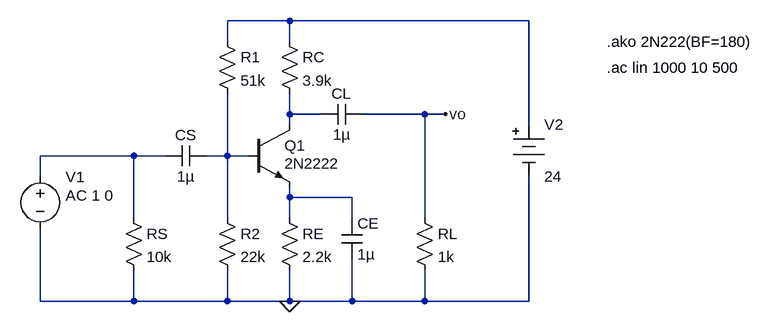
[diagram p0: schematic Draft23.asc]
Draft23.asc, the LTspice schematic file:
Version 4
SHEET 1 1008 680
WIRE 272 -80 176 -80
WIRE 640 -80 272 -80
WIRE 176 -48 176 -80
WIRE 272 -48 272 -80
WIRE 272 64 272 32
WIRE 320 64 272 64
WIRE 480 64 384 64
WIRE 512 64 480 64
WIRE 272 80 272 64
WIRE 640 80 640 -80
WIRE 32 128 -112 128
WIRE 80 128 32 128
WIRE 176 128 176 32
WIRE 176 128 144 128
WIRE 208 128 176 128
WIRE -112 160 -112 128
WIRE 272 192 272 176
WIRE 368 192 272 192
WIRE 32 224 32 128
WIRE 176 224 176 128
WIRE 272 224 272 192
WIRE 368 224 368 192
WIRE 480 224 480 64
WIRE -112 352 -112 240
WIRE 32 352 32 304
WIRE 32 352 -112 352
WIRE 176 352 176 304
WIRE 176 352 32 352
WIRE 272 352 272 304
WIRE 272 352 176 352
WIRE 368 352 368 288
WIRE 368 352 272 352
WIRE 480 352 480 304
WIRE 480 352 368 352
WIRE 640 352 640 160
WIRE 640 352 480 352
FLAG 512 64 vo
FLAG 272 352 0
SYMBOL voltage -112 144 R0
WINDOW 0 39 17 Left 2
WINDOW 123 39 45 Left 2
WINDOW 39 0 0 Left 0
SYMATTR InstName V1
SYMATTR Value ""
SYMATTR Value2 AC 1 0
SYMBOL res 160 -64 R0
SYMATTR InstName R1
SYMATTR Value 51k
SYMBOL res 160 208 R0
SYMATTR InstName R2
SYMATTR Value 22k
SYMBOL res 256 -64 R0
SYMATTR InstName RC
SYMATTR Value 3.9k
SYMBOL res 256 208 R0
SYMATTR InstName RE
SYMATTR Value 2.2k
SYMBOL res 464 208 R0
SYMATTR InstName RL
SYMATTR Value 1k
SYMBOL res 16 208 R0
SYMATTR InstName RS
SYMATTR Value 10k
SYMBOL cap 144 112 R90
WINDOW 0 0 32 VBottom 2
WINDOW 3 32 32 VTop 2
SYMATTR InstName CS
SYMATTR Value 1µ
SYMBOL cap 384 48 R90
WINDOW 0 0 32 VBottom 2
WINDOW 3 32 32 VTop 2
SYMATTR InstName CL
SYMATTR Value 1µ
SYMBOL cap 352 224 R0
SYMATTR InstName CE
SYMATTR Value 1µ
SYMBOL npn 208 80 R0
WINDOW 3 56 60 Left 2
SYMATTR InstName Q1
SYMATTR Value 2N2222
SYMBOL Misc\\battery 640 64 R0
WINDOW 123 0 0 Left 0
WINDOW 39 0 0 Left 0
SYMATTR InstName V2
SYMATTR Value 24
TEXT 760 -48 Left 2 !.ako 2N222(BF=180)
TEXT 760 -8 Left 2 !.ac lin 1000 10 500

The netlist it stands for:
* Draft23.asc
V1 N003 0 AC 1 0
R1 N001 N004 51k
R2 N004 0 22k
RC N001 N002 3.9k
RE N005 0 2.2k
RL vo 0 1k
RS N003 0 10k
CS N004 N003 1µ
CL vo N002 1µ
CE N005 0 1µ
Q1 N002 N004 N005 0 2N2222
V2 N001 0 24
.model NPN NPN
.model PNP PNP
.lib standard.bjt
.ako 2N222(BF=180)
.ac lin 1000 10 500
.backanno
.end